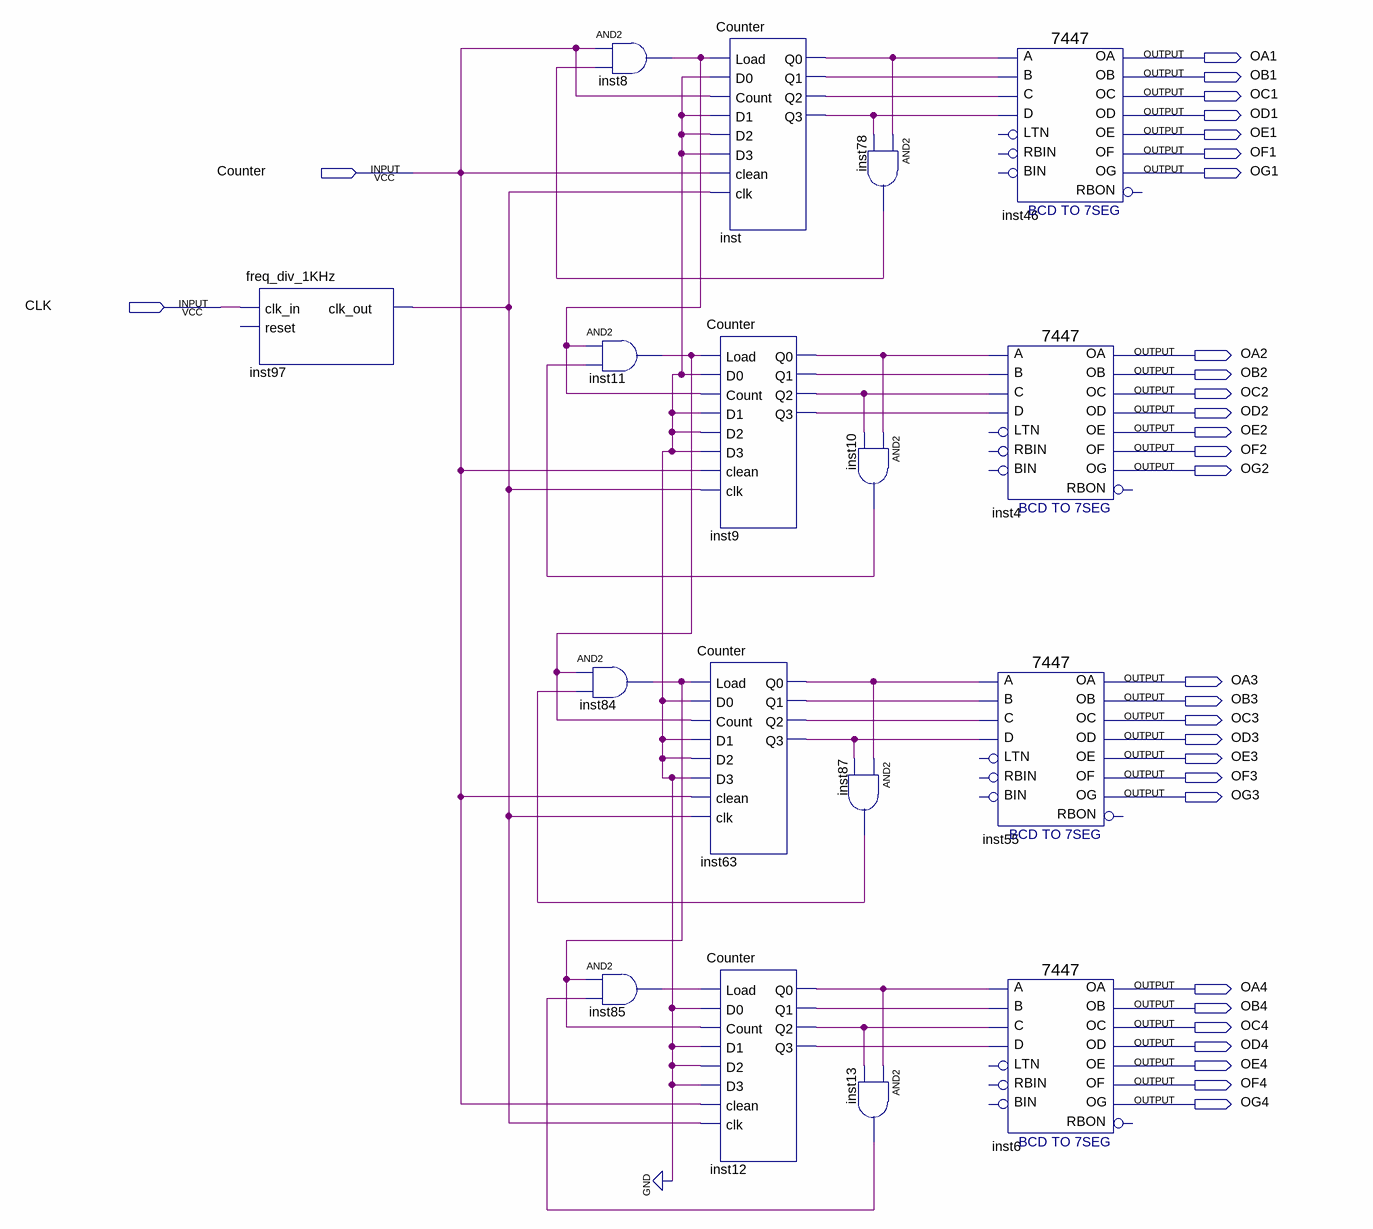
[diagram p0: schematic sheet]
// Quartus schematic Lab05.bdf as structural Verilog: 17 symbols, 30 pins
module Lab05 (
  input  Counter,
  input  CLK,
  output OA1,
  output OB1,
  output OC1,
  output OD1,
  output OE1,
  output OF1,
  output OG1,
  output OA2,
  output OB2,
  output OC2,
  output OD2,
  output OE2,
  output OF2,
  output OG2,
  output OA3,
  output OB3,
  output OC3,
  output OD3,
  output OE3,
  output OF3,
  output OG3,
  output OA4,
  output OB4,
  output OC4,
  output OD4,
  output OE4,
  output OF4,
  output OG4
);

  wire inst8_out, inst9_q0, inst9_q1, inst9_q2, inst9_q3, inst10_out, inst11_out, inst12_q0, inst12_q1,
       inst12_q2, inst12_q3, inst13_out, inst63_q0, inst63_q1, inst63_q2, inst63_q3, inst78_out, inst84_out,
       inst85_out, inst87_out, inst97_clk_out, inst_q0, inst_q1, inst_q2, inst_q3;

  freq_div_1KHz inst97 (.clk_in(CLK), .clk_out(inst97_clk_out));  // open: reset
  and inst8 (inst8_out, Counter, inst78_out);
  and inst11 (inst11_out, inst8_out, inst10_out);
  and inst84 (inst84_out, inst11_out, inst87_out);
  and inst85 (inst85_out, inst84_out, inst13_out);
  Counter inst (
    .Load(inst8_out), .D0(1'b0), .Count(Counter), .D1(1'b0), .D2(1'b0), .D3(1'b0), .clean(Counter),
    .clk(inst97_clk_out), .Q0(inst_q0), .Q1(inst_q1), .Q2(inst_q2), .Q3(inst_q3));
  Counter inst9 (
    .Load(inst11_out), .D0(1'b0), .Count(inst8_out), .D1(1'b0), .D2(1'b0), .D3(1'b0), .clean(Counter),
    .clk(inst97_clk_out), .Q0(inst9_q0), .Q1(inst9_q1), .Q2(inst9_q2), .Q3(inst9_q3));
  Counter inst63 (
    .Load(inst84_out), .D0(1'b0), .Count(inst11_out), .D1(1'b0), .D2(1'b0), .D3(1'b0), .clean(Counter),
    .clk(inst97_clk_out), .Q0(inst63_q0), .Q1(inst63_q1), .Q2(inst63_q2), .Q3(inst63_q3));
  Counter inst12 (
    .Load(inst85_out), .D0(1'b0), .Count(inst84_out), .D1(1'b0), .D2(1'b0), .D3(1'b0), .clean(Counter),
    .clk(inst97_clk_out), .Q0(inst12_q0), .Q1(inst12_q1), .Q2(inst12_q2), .Q3(inst12_q3));
  and inst87 (inst87_out, inst63_q0, inst63_q3);
  and inst78 (inst78_out, inst_q0, inst_q3);
  and inst10 (inst10_out, inst9_q0, inst9_q2);
  and inst13 (inst13_out, inst12_q0, inst12_q2);
  \7447  inst4 (
    .B(inst9_q1), .C(inst9_q2), .D(inst9_q3), .A(inst9_q0), .OB(OB2), .OC(OC2), .OE(OE2), .OD(OD2), .OF(OF2),
    .OG(OG2), .OA(OA2));  // open: LTN, RBIN, BIN, RBON
  \7447  inst55 (
    .B(inst63_q1), .C(inst63_q2), .D(inst63_q3), .A(inst63_q0), .OB(OB3), .OC(OC3), .OE(OE3), .OD(OD3),
    .OF(OF3), .OG(OG3), .OA(OA3));  // open: LTN, RBIN, BIN, RBON
  \7447  inst6 (
    .B(inst12_q1), .C(inst12_q2), .D(inst12_q3), .A(inst12_q0), .OB(OB4), .OC(OC4), .OE(OE4), .OD(OD4),
    .OF(OF4), .OG(OG4), .OA(OA4));  // open: LTN, RBIN, BIN, RBON
  \7447  inst46 (
    .B(inst_q1), .C(inst_q2), .D(inst_q3), .A(inst_q0), .OB(OB1), .OC(OC1), .OE(OE1), .OD(OD1), .OF(OF1),
    .OG(OG1), .OA(OA1));  // open: LTN, RBIN, BIN, RBON
endmodule
